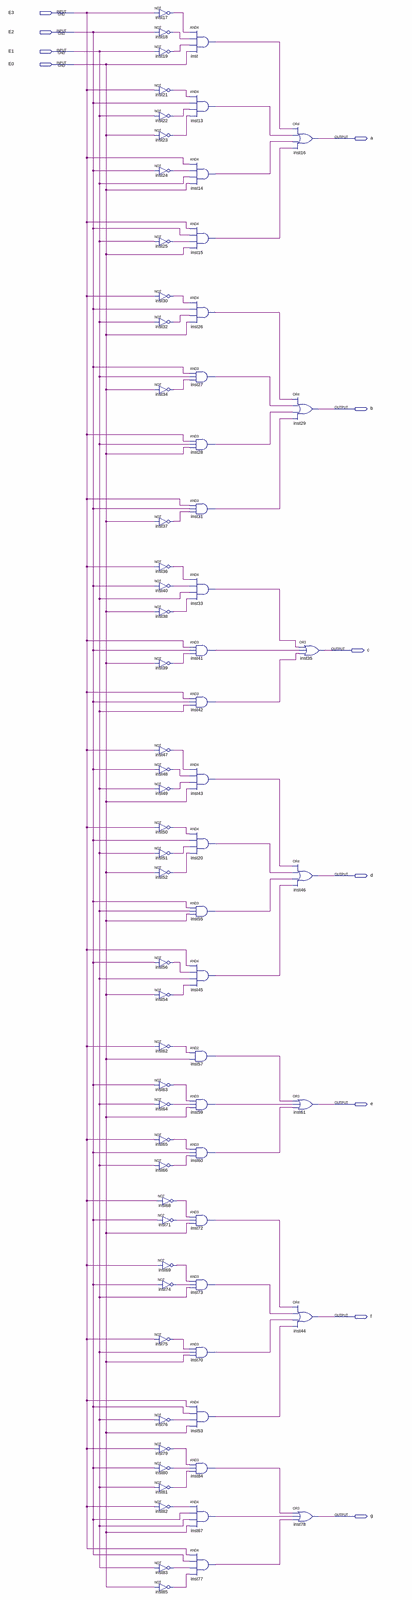
[diagram p0: schematic sheet, whole]
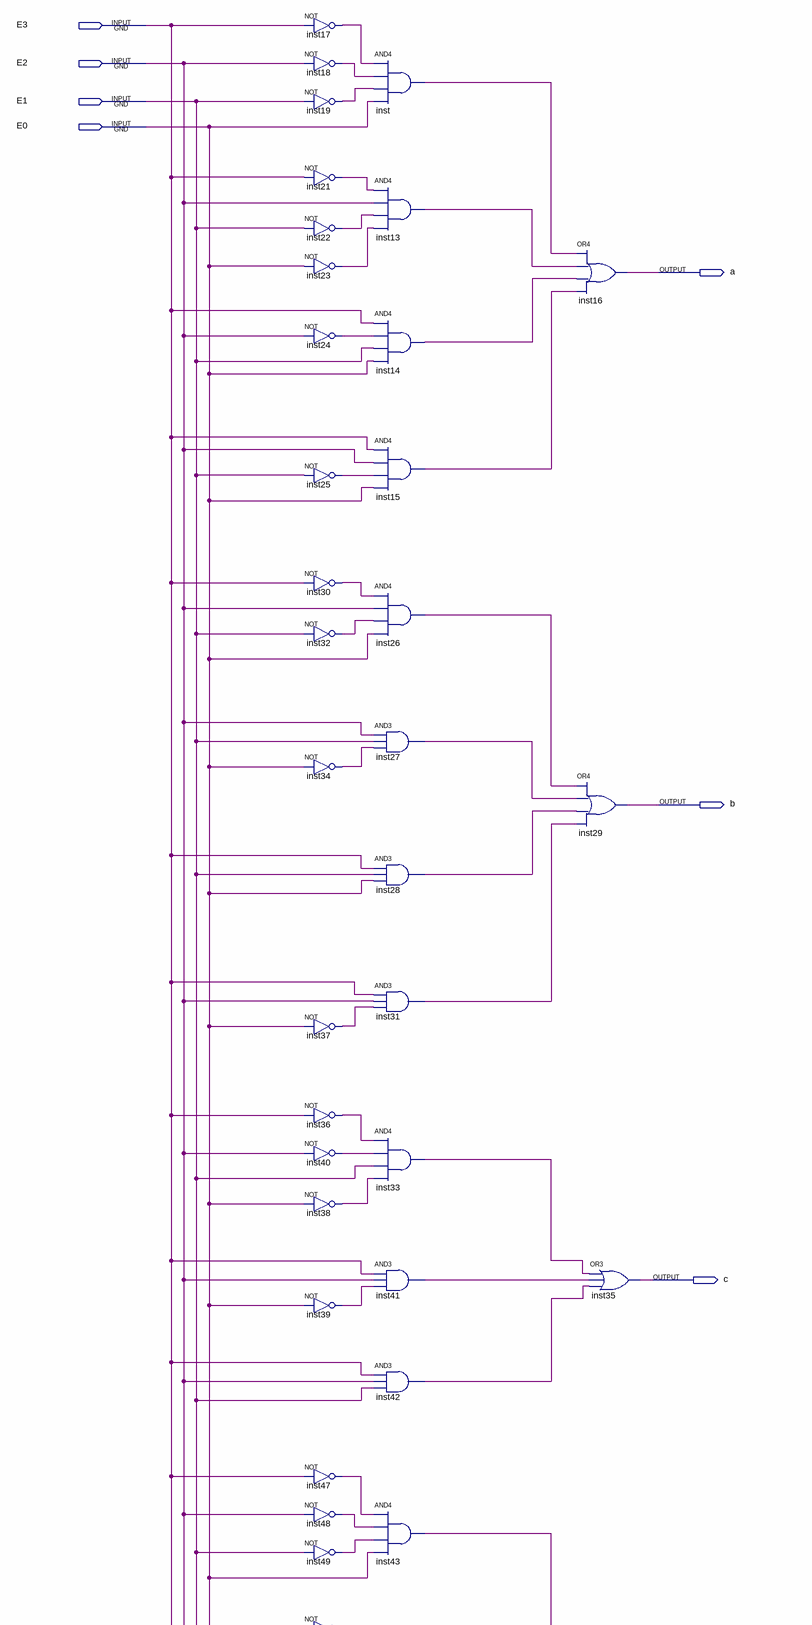
[diagram p1: schematic sheet, upper part]
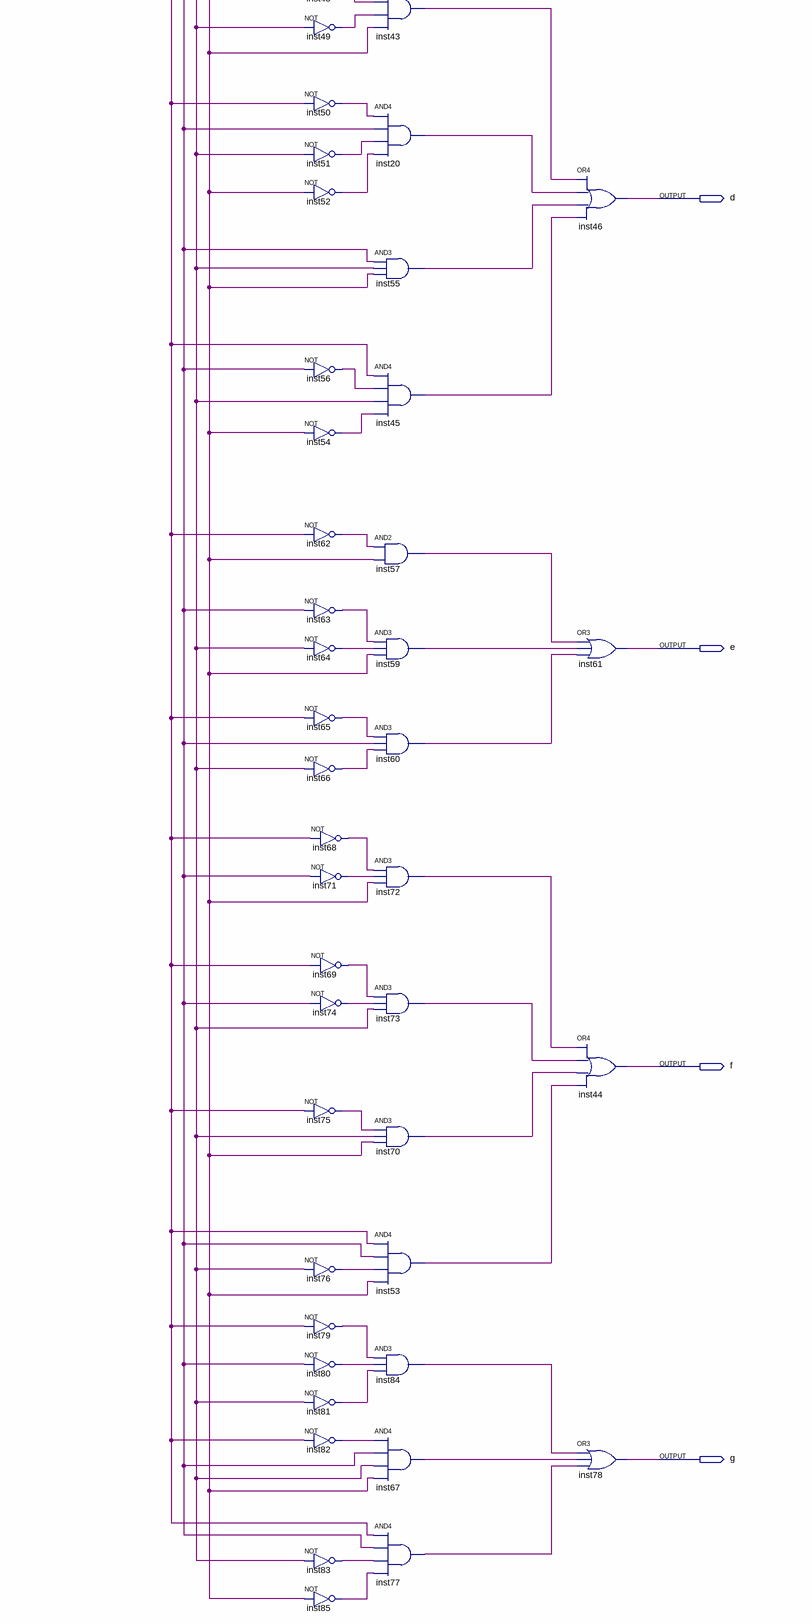
[diagram p2: schematic sheet, lower part]
// Quartus schematic Decod_7Seg.bdf as structural Verilog: 73 symbols, 11 pins
module Decod_7Seg (
  input  E3,
  input  E2,
  input  E1,
  input  E0,
  output a,
  output b,
  output c,
  output d,
  output e,
  output f,
  output g
);

  wire inst13_out, inst14_out, inst15_out, inst17_out, inst18_out, inst19_out, inst20_out, inst21_out,
       inst22_out, inst23_out, inst24_out, inst25_out, inst26_out, inst27_out, inst28_out, inst30_out,
       inst31_out, inst32_out, inst33_out, inst34_out, inst36_out, inst37_out, inst38_out, inst39_out,
       inst40_out, inst41_out, inst42_out, inst43_out, inst45_out, inst47_out, inst48_out, inst49_out,
       inst50_out, inst51_out, inst52_out, inst53_out, inst54_out, inst55_out, inst56_out, inst57_out,
       inst59_out, inst60_out, inst62_out, inst63_out, inst64_out, inst65_out, inst66_out, inst67_out,
       inst68_out, inst69_out, inst70_out, inst71_out, inst72_out, inst73_out, inst74_out, inst75_out,
       inst76_out, inst77_out, inst79_out, inst80_out, inst81_out, inst82_out, inst83_out, inst84_out,
       inst85_out, inst_out;

  not inst17 (inst17_out, E3);
  not inst18 (inst18_out, E2);
  not inst19 (inst19_out, E1);
  not inst21 (inst21_out, E3);
  not inst22 (inst22_out, E1);
  not inst23 (inst23_out, E0);
  not inst24 (inst24_out, E2);
  not inst25 (inst25_out, E1);
  not inst30 (inst30_out, E3);
  not inst32 (inst32_out, E1);
  not inst34 (inst34_out, E0);
  not inst37 (inst37_out, E0);
  not inst36 (inst36_out, E3);
  not inst40 (inst40_out, E2);
  not inst38 (inst38_out, E0);
  not inst39 (inst39_out, E0);
  not inst47 (inst47_out, E3);
  not inst48 (inst48_out, E2);
  not inst49 (inst49_out, E1);
  not inst50 (inst50_out, E3);
  not inst51 (inst51_out, E1);
  not inst52 (inst52_out, E0);
  not inst56 (inst56_out, E2);
  not inst54 (inst54_out, E0);
  not inst62 (inst62_out, E3);
  not inst63 (inst63_out, E2);
  not inst64 (inst64_out, E1);
  not inst65 (inst65_out, E3);
  not inst66 (inst66_out, E1);
  not inst68 (inst68_out, E3);
  not inst71 (inst71_out, E2);
  not inst69 (inst69_out, E3);
  not inst74 (inst74_out, E2);
  not inst75 (inst75_out, E3);
  not inst76 (inst76_out, E1);
  not inst79 (inst79_out, E3);
  not inst80 (inst80_out, E2);
  not inst81 (inst81_out, E1);
  not inst82 (inst82_out, E3);
  not inst83 (inst83_out, E1);
  not inst85 (inst85_out, E0);
  and inst (inst_out, inst17_out, inst18_out, inst19_out, E0);
  and inst13 (inst13_out, inst21_out, E2, inst22_out, inst23_out);
  and inst14 (inst14_out, E3, inst24_out, E1, E0);
  and inst15 (inst15_out, E3, E2, inst25_out, E0);
  and inst26 (inst26_out, inst30_out, E2, inst32_out, E0);
  and inst27 (inst27_out, E2, E1, inst34_out);
  and inst28 (inst28_out, E3, E1, E0);
  and inst31 (inst31_out, E3, E2, inst37_out);
  and inst33 (inst33_out, inst36_out, inst40_out, E1, inst38_out);
  and inst41 (inst41_out, E3, E2, inst39_out);
  and inst42 (inst42_out, E3, E2, E1);
  and inst43 (inst43_out, inst47_out, inst48_out, inst49_out, E0);
  and inst20 (inst20_out, inst50_out, E2, inst51_out, inst52_out);
  and inst55 (inst55_out, E2, E1, E0);
  and inst45 (inst45_out, E3, inst56_out, E1, inst54_out);
  and inst57 (inst57_out, inst62_out, E0);
  and inst59 (inst59_out, inst63_out, inst64_out, E0);
  and inst60 (inst60_out, inst65_out, E2, inst66_out);
  and inst72 (inst72_out, inst68_out, inst71_out, E0);
  and inst73 (inst73_out, inst69_out, inst74_out, E1);
  and inst70 (inst70_out, inst75_out, E1, E0);
  and inst53 (inst53_out, E3, E2, inst76_out, E0);
  and inst84 (inst84_out, inst79_out, inst80_out, inst81_out);
  and inst67 (inst67_out, inst82_out, E2, E1, E0);
  and inst77 (inst77_out, E3, E2, inst83_out, inst85_out);
  or inst16 (a, inst_out, inst13_out, inst14_out, inst15_out);
  or inst29 (b, inst26_out, inst27_out, inst28_out, inst31_out);
  or inst35 (c, inst33_out, inst41_out, inst42_out);
  or inst46 (d, inst43_out, inst20_out, inst55_out, inst45_out);
  or inst61 (e, inst57_out, inst59_out, inst60_out);
  or inst44 (f, inst72_out, inst73_out, inst70_out, inst53_out);
  or inst78 (g, inst84_out, inst67_out, inst77_out);
endmodule
